# EAGLE design analog_only_disc (EAGLE 4.16)
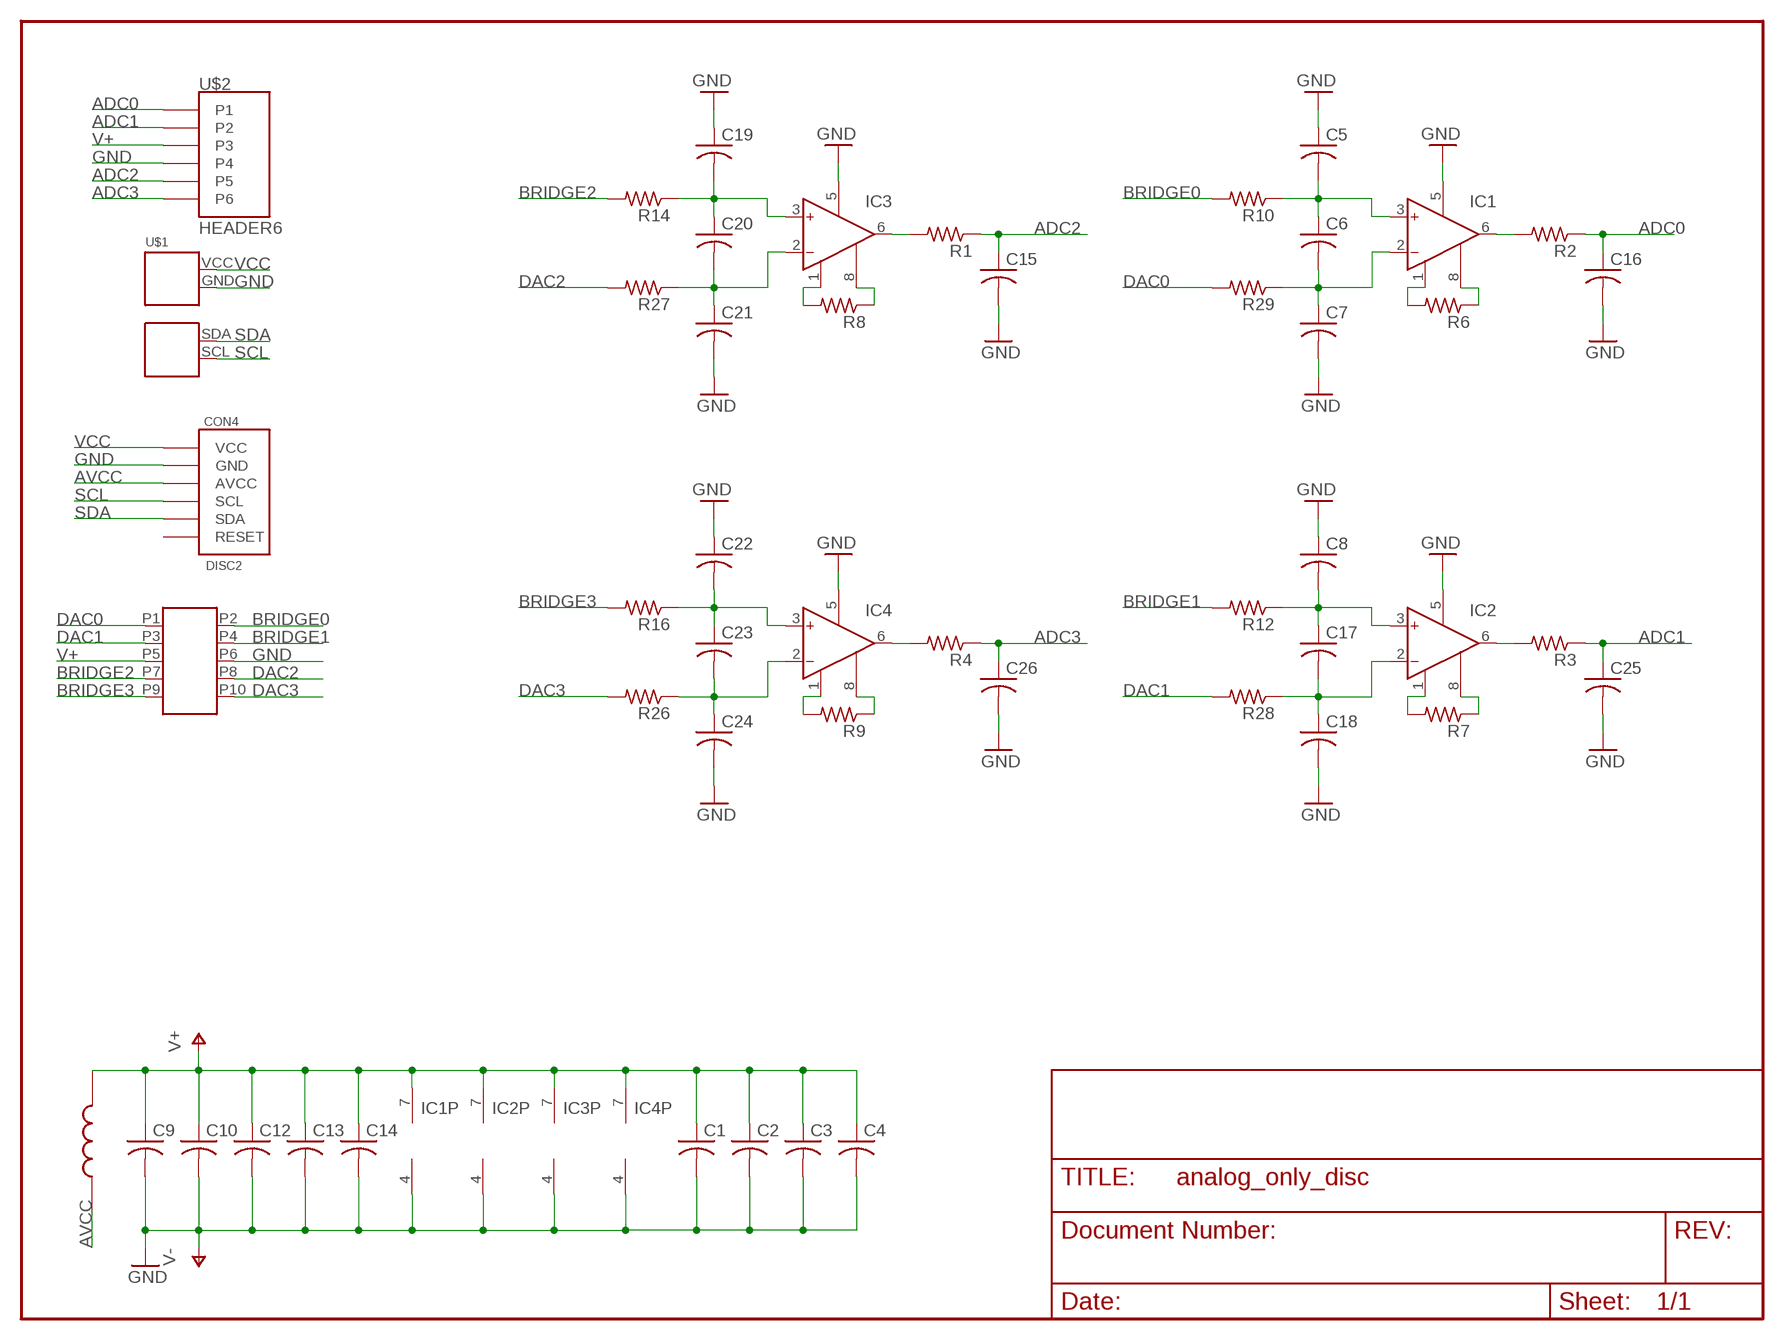
[diagram p0: schematic, sheet 1]

## Parts
C1  C-USC0805  [C0805]
C2  C-USC0805  [C0805]
C3  C-USC0805  [C0805]
C4  C-USC0805  [C0805]
C5  C-USC0603  [C0603]
C6  C-USC0603  [C0603]
C7  C-USC0603  [C0603]
C8  C-USC0603  [C0603]
C9  C-USC0805  [C0805]
C10  C-USC0805  [C0805]
C12  C-USC0805  [C0805]
C13  C-USC0805  [C0805]
C14  C-USC0805  [C0805]
C15  C-USC0603  [C0603]
C16  C-USC0603  [C0603]
C17  C-USC0603  [C0603]
C18  C-USC0603  [C0603]
C19  C-USC0603  [C0603]
C20  C-USC0603  [C0603]
C21  C-USC0603  [C0603]
C22  C-USC0603  [C0603]
C23  C-USC0603  [C0603]
C24  C-USC0603  [C0603]
C25  C-USC0603  [C0603]
C26  C-USC0603  [C0603]
CON4  DISC2  [DISC2]
IC1  AD627  [SOIC8]
IC2  AD627  [SOIC8]
IC3  AD627  [SOIC8]
IC4  AD627  [SOIC8]
L2  IND0805  [M0805]
R1  R-US_R0603  [R0603]
R2  R-US_R0603  [R0603]
R3  R-US_R0603  [R0603]
R4  R-US_R0603  [R0603]
R6  R-US_R0603  [R0603]
R7  R-US_R0603  [R0603]
R8  R-US_R0603  [R0603]
R9  R-US_R0603  [R0603]
R10  R-US_R0603  [R0603]
R12  R-US_R0603  [R0603]
R14  R-US_R0603  [R0603]
R16  R-US_R0603  [R0603]
R26  R-US_R0603  [R0603]
R27  R-US_R0603  [R0603]
R28  R-US_R0603  [R0603]
R29  R-US_R0603  [R0603]
U$1  ANGLEHEADER  [ANGLEHEADER2]
U$2  HEADER6  [HEADER6]
U$3  HEADER2X5  [HEADER2X5]

## Nets
ADC0: C16.1 R2.1 U$2.P1
ADC1: C25.1 R3.1 U$2.P2
ADC2: C15.1 R1.1 U$2.P5
ADC3: C26.1 R4.1 U$2.P6
AVCC: CON4.AVCC L2.1
BRIDGE0: R10.2 U$3.P2
BRIDGE1: R12.2 U$3.P4
BRIDGE2: R14.2 U$3.P7
BRIDGE3: R16.2 U$3.P9
DAC0: R29.2 U$3.P1
DAC1: R28.2 U$3.P3
DAC2: R27.2 U$3.P8
DAC3: R26.2 U$3.P10
GND: C1.2 C2.2 C3.2 C4.2 C5.1 C7.2 C8.1 C9.2 C10.2 C12.2 C13.2 C14.2 C15.2 C16.2 C18.2 C19.1 C21.2 C22.1 C24.2 C25.2 C26.2 CON4.GND IC1.4(V-) IC1.5(REF) IC2.4(V-) IC2.5(REF) IC3.4(V-) IC3.5(REF) IC4.4(V-) IC4.5(REF) U$1.GND U$2.P4 U$3.P6 ; supply symbol labelled V-
N$1: C6.2 C7.1 IC1.2(IN-) R29.1
N$2: IC4.6(OUT) R4.2
N$3: IC3.6(OUT) R1.2
N$4: IC1.6(OUT) R2.2
N$5: IC2.6(OUT) R3.2
N$8: IC2.8(RG2) R7.1
N$10: IC2.1(RG1) R7.2
N$11: IC3.1(RG1) R8.2
N$12: IC3.8(RG2) R8.1
N$13: IC4.1(RG1) R9.2
N$14: IC4.8(RG2) R9.1
N$15: IC1.1(RG1) R6.2
N$16: IC1.8(RG2) R6.1
N$17: C5.2 C6.1 IC1.3(IN+) R10.1
N$19: C8.2 C17.1 IC2.3(IN+) R12.1
N$20: C22.2 C23.1 IC4.3(IN+) R16.1
N$23: C19.2 C20.1 IC3.3(IN+) R14.1
N$27: C17.2 C18.1 IC2.2(IN-) R28.1
N$30: C23.2 C24.1 IC4.2(IN-) R26.1
N$31: C20.2 C21.1 IC3.2(IN-) R27.1
SCL: CON4.SCL U$1.SCL
SDA: CON4.SDA U$1.SDA
V+: C1.1 C2.1 C3.1 C4.1 C9.1 C10.1 C12.1 C13.1 C14.1 IC1.7(V+) IC2.7(V+) IC3.7(V+) IC4.7(V+) L2.2 U$2.P3 U$3.P5
VCC: CON4.VCC U$1.VCC
Unconnected: CON4.RESET

## Library data of the parts
C1-C10 C12-C26 = rcl:C-US: CAPACITOR, American symbol
CON4 = anton:DISC2
IC1-IC4 = anton:AD627: ANALOG DEVICES
L2 = anton:IND0805
R1-R4 R6-R10 R12 R14 R16 R26-R29 = rcl:R-US_: RESISTOR, American symbol
U$1 = mike:ANGLEHEADER
U$2 = anton:HEADER6
U$3 = anton:HEADER2X5

## Board
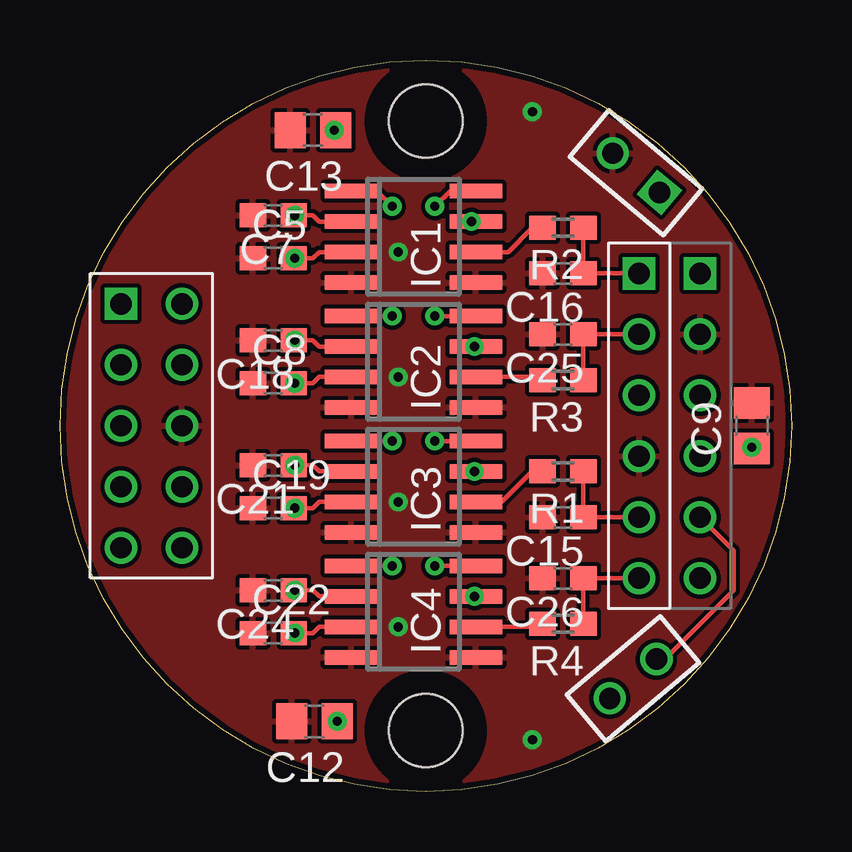
[diagram p1: board, top side]
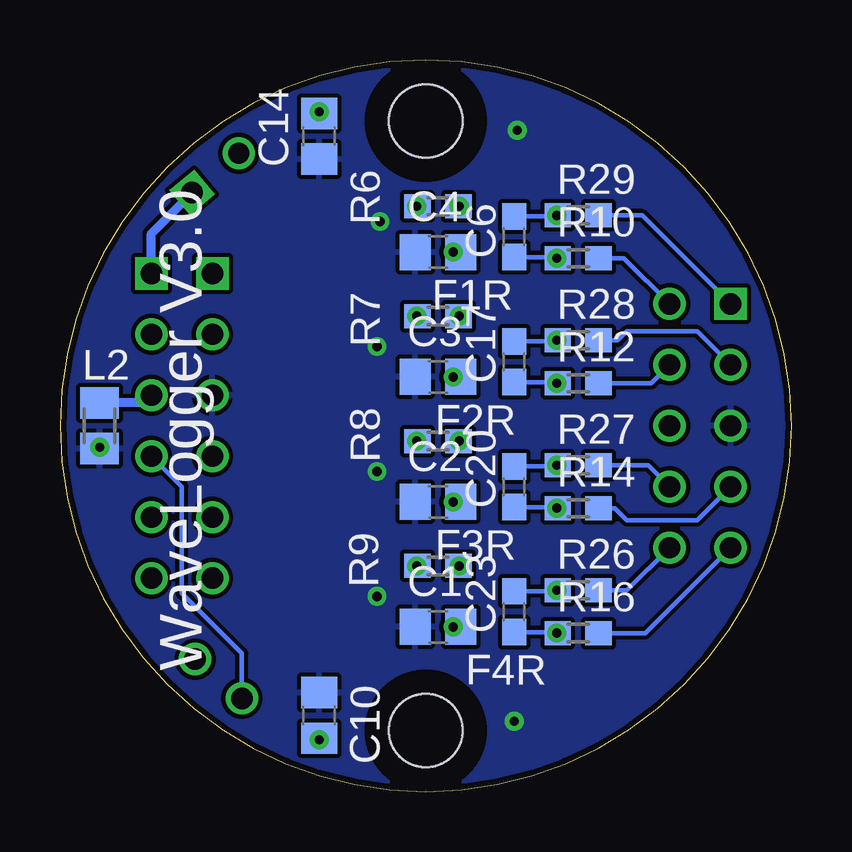
[diagram p2: board, bottom side, seen from below]

Size 30.48 x 30.48 mm. Coordinates in mm from the lower left corner, seen from the top.
Copper layers (1*16): Top 0.035mm / dielectric 1.5mm / Bottom 0.035mm
Design rules "AdvancedCircuts": minimum track width 7mil, minimum drill 15mil, track to track 7mil, track to pad 7mil, pad to pad 7mil, via to via 7mil, smd to smd 0mil, copper to edge 10mil, drill to drill 8mil, minimum pad ring 9mil, minimum via ring 8mil, stop-mask expansion 4mil, vias tented up to drill 0mil, thermal gap 7mil

### Footprints (pad centres in the part's own frame; a part is rotated, then mirrored left to right if it is on the bottom)
C0805 = smd 1.3 x 1.5: 1 -0.95,0; 2 0.95,0
C0603 = smd 1.1 x 1: 1 -0.85,0; 2 0.85,0
DISC2 = drill 0.889 round: AVCC 11.43,1.27; GND 11.43,3.81; RESET 11.43,-6.35; SCL 11.43,-1.27; SDA 11.43,-3.81 | drill 0.889 square: VCC 11.43,6.35 | hole 3.048: 0,-12.7; 0,12.7
SOIC8 = smd 0.6 x 2.2: 1 -1.905,-2.6; 2 -0.635,-2.6; 3 0.635,-2.6; 4 1.905,-2.6; 5 1.905,2.6; 6 0.635,2.6; 7 -0.635,2.6; 8 -1.905,2.6
M0805 = smd 1.3 x 1.6: 1 -0.95,0; 2 0.95,0
R0603 = smd 1.1 x 1: 1 -0.85,0; 2 0.85,0
ANGLEHEADER2 = drill 0.889 round: GND 7.79,11.357; SCL 7.663,-11.357; SDA 9.609,-9.725 | drill 0.889 square: VCC 9.736,9.725
HEADER6 = drill 0.889 square: P1 0,6.35 | drill 0.889 round: P2 0,3.81; P3 0,1.27; P4 0,-1.27; P5 0,-3.81; P6 0,-6.35
HEADER2X5 = drill 0.889 square: P1 -1.27,5.08 | drill 0.889 round: P2 1.27,5.08; P3 -1.27,2.54; P4 1.27,2.54; P5 -1.27,0; P6 1.27,0; P7 -1.27,-2.54; P8 1.27,-2.54; P9 -1.27,-5.08; P10 1.27,-5.08

### Placement (x,y rotation side)
C1  14.73,6.86 0 bottom
C2  14.73,12.07 0 bottom
C3  14.73,17.27 0 bottom
C4  14.73,22.48 0 bottom
C5  8.89,22.22 0 top
C6  11.56,23.11 90 bottom
C7  8.89,24 180 top
C8  8.89,17.02 0 top
C9  28.83,15.24 90 top
C10  19.69,3.18 270 bottom
C12  10.6,2.92 180 top
C13  10.54,27.56 180 top
C14  19.69,27.31 90 bottom
C15  20.95,11.43 180 top
C16  20.95,21.59 180 top
C17  11.56,17.91 90 bottom
C18  8.89,18.8 180 top
C19  8.89,11.81 0 top
C20  11.56,12.7 90 bottom
C21  8.89,13.59 180 top
C22  8.89,6.6 0 top
C23  11.56,7.49 90 bottom
C24  8.89,8.38 180 top
C25  20.95,19.05 180 top
C26  20.95,8.89 180 top
CON4  15.24,15.24 0 top
IC1  14.73,23.11 270 top
IC2  14.73,17.91 270 top
IC3  14.73,12.7 270 top
IC4  14.73,7.49 270 top
L2  28.83,15.24 270 bottom
R1  20.95,13.34 180 top
R2  20.95,23.5 180 top
R3  20.95,17.14 180 top
R4  20.95,6.98 180 top
R6  14.73,24.38 0 bottom
R7  14.73,19.81 0 bottom
R8  14.73,14.61 0 bottom
R9  14.73,9.4 0 bottom
R10  8.89,22.22 0 bottom
R12  8.89,17.02 0 bottom
R14  8.89,11.81 0 bottom
R16  8.89,6.6 0 bottom
R26  8.89,8.38 0 bottom
R27  8.89,13.59 0 bottom
R28  8.89,18.8 0 bottom
R29  8.89,24 0 bottom
U$1  15.24,15.24 0 top
U$2  24.13,15.24 0 top
U$3  3.81,15.24 0 top

### Tracks (layer width: path | path; a pad name or v marks a point on that pad's centre or on a via)
ADC0
  Top 0.178: C16.1 R2.1 | C16.1 22.23,21.59 | C16.1 U$2.P1
ADC1
  Top 0.178: R3.1 C25.1 | C25.1 22.23,19.05 | C25.1 U$2.P2
ADC2
  Top 0.178: C15.1 R1.1 | C15.1 22.23,11.43 | C15.1 U$2.P5
ADC3
  Top 0.178: R4.1 C26.1 | C26.1 22.23,8.89 | C26.1 U$2.P6
AVCC
  Bottom 0.381: L2.1 26.99,16.19 CON4.AVCC
  Bottom 0.406: L2.1 28.83,16.13
BRIDGE0
  Bottom 0.178: R10.2 6.99,22.22 U$3.P2
BRIDGE1
  Bottom 0.178: R12.2 5.84,17.02 U$3.P4
BRIDGE2
  Bottom 0.178: R14.2 7.37,11.81 6.86,11.3 3.94,11.3 U$3.P7
BRIDGE3
  Bottom 0.178: R16.2 6.1,6.6 U$3.P9
DAC0
  Bottom 0.178: R29.2 6.22,24 U$3.P1
DAC1
  Bottom 0.178: R28.2 7.24,18.8 6.86,19.18 3.94,19.18 U$3.P3
DAC2
  Bottom 0.178: R27.2 5.97,13.59 U$3.P8
DAC3
  Bottom 0.178: R26.2 6.86,8.38 U$3.P10
GND  (via drill 0.38, 0.38 pad 0.64)
  Top 0.178: v14.1,17.27 13.97,17.27 | v14.1,12.07 13.84,12.07
  Bottom 0.178: C4.2 v14.1,22.48 | C3.2 v14.1,17.27 | C2.2 v14.1,12.07 | C1.2 v14.1,6.86 | C10.2 v19.69,2.16 | C14.2 v19.69,28.32
  pour Top: 30.48,15.24 arc-90 15.24,0 arc-90 0,15.24 arc-90 15.24,30.48 arc-90
N$1  (via drill 0.38)
  Top 0.178: IC1.2 10.79,23.75 10.54,24 C7.1 v9.78,24
  Bottom 0.178: v9.78,24 C7.1 v9.78,24 | v9.78,24 10.03,24 | C6.2 9.82,23.96 v9.78,24
N$2
  Top 0.178: R4.2 20.32,6.98 20.19,6.86 IC4.6
N$3
  Top 0.178: R1.2 19.69,13.34 18.41,12.07 IC3.6
N$4
  Top 0.178: R2.2 19.69,23.5 18.67,22.48 IC1.6
N$5
  Top 0.178: R3.2 20.32,17.14 20.19,17.27 IC2.6
N$8  (via drill 0.38)
  Top 0.178: v15.62,19.81 IC2.8
  Bottom 0.178: R7.1 v15.62,19.81
N$10  (via drill 0.38)
  Top 0.178: IC2.1 v13.84,19.81
  Bottom 0.178: v13.84,19.81 R7.2
N$11  (via drill 0.38 pad 0.64)
  Top 0.178: IC3.1 v13.84,14.61 IC3.1
  Bottom 0.178: v13.84,14.61 R8.2
N$12  (via drill 0.38 pad 0.64)
  Top 0.178: v15.62,14.61 IC3.8
  Bottom 0.178: R8.1 v15.62,14.61
N$13  (via drill 0.38)
  Top 0.178: IC4.1 v13.84,9.4
  Bottom 0.178: v13.84,9.4 R9.2
N$14  (via drill 0.38)
  Top 0.178: v15.62,9.4 IC4.8
  Bottom 0.178: R9.1 v15.62,9.4
N$15  (via drill 0.38)
  Top 0.178: IC1.1 13.21,25.02 v13.84,24.38
  Bottom 0.178: v13.84,24.38 R6.2
N$16  (via drill 0.38)
  Top 0.178: IC1.8 16.26,25.02 v15.62,24.38
  Bottom 0.178: R6.1 v15.62,24.38
N$17  (via drill 0.38)
  Top 0.178: IC1.3 10.79,22.48 10.54,22.22 R10.1 v9.78,22.22
  Bottom 0.178: R10.1 v9.78,22.22 9.82,22.26 C6.1
N$19  (via drill 0.38)
  Top 0.178: IC2.3 10.79,17.27 10.54,17.02 C8.2 v9.78,17.02
  Bottom 0.178: C8.2 v9.78,17.02 9.82,17.06 C17.1
N$20  (via drill 0.38)
  Top 0.178: IC4.3 10.79,6.86 10.54,6.6 C22.2 v9.78,6.6
  Bottom 0.178: C22.2 v9.78,6.6 9.82,6.64 C23.1
N$23  (via drill 0.38)
  Top 0.178: IC3.3 10.79,12.07 10.54,11.81 R14.1 | R14.1 9.65,11.81 | v9.78,11.81 R14.1
  Bottom 0.178: R14.1 v9.78,11.81 9.82,11.85 C20.1
N$27  (via drill 0.38)
  Top 0.178: IC2.2 10.79,18.54 10.54,18.8 C18.1 v9.78,18.8
  Bottom 0.178: C18.1 v9.78,18.8 9.82,18.76 C17.2
N$30  (via drill 0.38)
  Top 0.178: IC4.2 10.79,8.13 10.54,8.38 C24.1 v9.78,8.38
  Bottom 0.178: C24.1 v9.78,8.38 9.82,8.34 C23.2
N$31  (via drill 0.38)
  Top 0.178: IC3.2 10.79,13.34 10.54,13.59 R27.1 v9.78,13.59
  Bottom 0.178: R27.1 v9.78,13.59 9.82,13.55 C20.2
SCL
  Bottom 0.178: CON4.SCL 25.4,12.7 25.4,8.25 22.9,5.76 U$1.SCL
SDA
  Top 0.178: CON4.SDA 28.07,10.03 28.07,8.38 25.2,5.52 U$1.SDA
V+  (via drill 0.38, 0.38 pad 0.64)
  Top 0.178: IC4.7 v17.27,8.13 | IC1.7 v17.15,23.75 | IC2.7 v17.27,18.54 | C13.1 v11.43,27.56 | C9.1 v28.83,14.35 | IC3.7 v17.27,13.34 | C12.1 v11.56,2.92
  Bottom 0.178: 28.83,14.22 C9.1 v28.83,14.35
  pour Bottom: 15.24,30.48 arc-90 30.48,15.24 arc-90 15.24,0 arc-90 0,15.24 arc-90
VCC
  Bottom 0.381: 24.95,24.96 24.89,25.02 | 24.95,24.96 U$1.VCC | CON4.VCC 26.67,23.24 24.95,24.96

### Text on the board
bNames: WaveLogger V3.0 | F1R | F2R | F3R | F4R